# EAGLE design mcp1700_breakout (EAGLE 7.5.0)
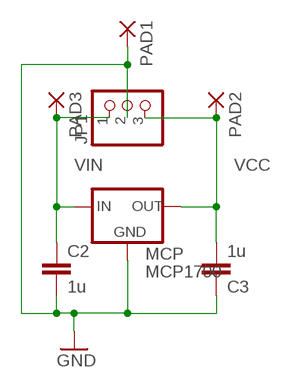
[diagram p0: schematic, sheet 1]

## Parts
C2  1u  C-EUC0805  [C0805]
C3  1u  C-EUC0805  [C0805]
JP1  PINHD-1X3  [1X03]
MCP  MCP1700  MCP1700SOT-23  [SOT-23]
PAD1  SMD2  [SMD1,27-2,54]
PAD2  SMD2  [SMD1,27-2,54]
PAD3  SMD2  [SMD1,27-2,54]

## Nets
GND [GND]: C2.2 C3.1 JP1.2 MCP.1(GND) PAD1.1(P)
VCC [VCC]: C3.2 JP1.3 MCP.2(OUT) PAD2.1(P)
VIN [VCC]: C2.1 JP1.1 MCP.3(IN) PAD3.1(P)

## Library data of the parts
C2 C3 = rcl:C-EU: CAPACITOR, European symbol
JP1 = pinhead:PINHD-1X3: PIN HEADER
MCP = MY_IC:MCP1700
PAD1-PAD3 = wirepad:SMD2: SMD PAD

## Net classes
0 default: width 0.406 mm, drill 0.508 mm
1 GND: width 0.508 mm, drill 0.508 mm
2 VCC: width 1.016 mm, drill 0.508 mm
4 VCCEXT: width 0.762 mm, drill 0.508 mm, clearance 0.229 mm

## Board
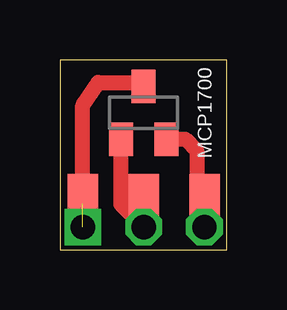
[diagram p1: board, top side]
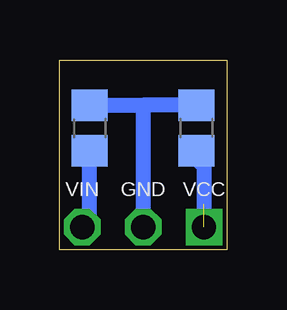
[diagram p2: board, bottom side, seen from below]

Size 6.96 x 7.92 mm. Coordinates in mm from the lower left corner, seen from the top.
Outline: 0,0 6.96,0 6.96,7.92 0,7.92 0,0
Copper layers (1*16): Top 0.035mm / dielectric 1.5mm / Bottom 0.035mm
Design rules "default": minimum track width 10mil, minimum drill 24mil, track to track 8mil, track to pad 8mil, pad to pad 8mil, via to via 8mil, smd to smd 8mil, copper to edge 40mil, drill to drill 8mil, minimum pad ring 10mil, minimum via ring 8mil, stop-mask expansion 4mil, vias tented up to drill 0mil, thermal gap 10mil

### Footprints (pad centres in the part's own frame; a part is rotated, then mirrored left to right if it is on the bottom)
C0805 = smd 1.3 x 1.5: 1 -0.95,0; 2 0.95,0
1X03 = drill 1.016 square: 1 -2.54,0 | drill 1.016 octagon: 2 0,0; 3 2.54,0
SOT-23 = smd 1 x 1.4: 1 -0.95,-1.1; 2 0.95,-1.1; 3 0,1.1
SMD1,27-2,54 = smd 1.27 x 2.54: 1 0,0

### Placement (x,y rotation side)
C2  1.27,5.08 90 bottom
C3  5.71,5.08 270 bottom
JP1  3.49,0.95 0 top
MCP  3.49,5.71 0 top
PAD1  3.49,1.91 0 top
PAD2  6.03,1.91 0 top
PAD3  0.95,1.91 0 top

### Tracks (layer width: path | path; a pad name or v marks a point on that pad's centre or on a via)
GND
  Top 0.635: JP1.2 2.54,1.9 2.54,2.22 | 2.54,2.22 MCP.1 | PAD1.1 3.18,1.59 2.54,2.22
  Bottom 0.635: C3.1 3.49,6.03 | C2.2 3.49,6.03 | 3.49,6.03 3.49,5.71 JP1.2
VCC
  Top 0.635: PAD2.1 JP1.3 5.71,1.27 C3.2 5.23,4.62 MCP.2
  Bottom 0.635: JP1.3 5.71,1.27 C3.2
VIN  (1 unrouted)
  Top 0.635: JP1.1 0.95,6.03 1.59,6.99 3.49,6.99 MCP.3
  Bottom 0.635: C2.1 1.27,3.81 0.95,3.49 JP1.1

### Text on the board
tNames: MCP1700
bNames: VCC | GND | VIN